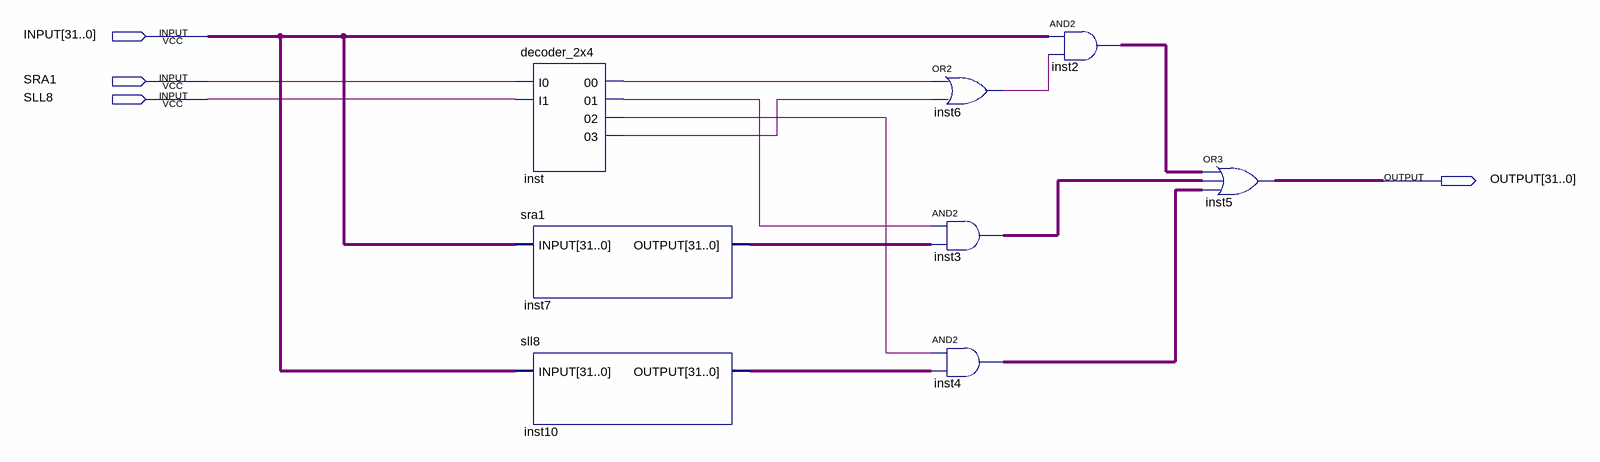
[diagram p0: schematic sheet]
// Quartus schematic shifter.bdf as structural Verilog: 8 symbols, 4 pins
module shifter (
  input  [31:0] INPUT,
  input  SRA1,
  input  SLL8,
  output [31:0] OUTPUT
);

  wire inst6_out, inst_00, inst_01, inst_02, inst_03;
  wire [31:0] inst2_out, inst3_out, inst4_out, inst7_output, inst10_output;

  decoder_2x4 inst (.I0(SRA1), .I1(SLL8), .\00 (inst_00), .\01 (inst_01), .\02 (inst_02), .\03 (inst_03));
  sra1 inst7 (.INPUT(INPUT), .OUTPUT(inst7_output));
  sll8 inst10 (.INPUT(INPUT), .OUTPUT(inst10_output));
  or inst6 (inst6_out, inst_00, inst_03);
  assign inst3_out = {32{inst_01}} & inst7_output;  // AND2 inst3, 32 bits wide
  assign inst4_out = {32{inst_02}} & inst10_output;  // AND2 inst4, 32 bits wide
  assign inst2_out = INPUT & {32{inst6_out}};  // AND2 inst2, 32 bits wide
  assign OUTPUT = inst2_out | inst3_out | inst4_out;  // OR3 inst5, 32 bits wide
endmodule
